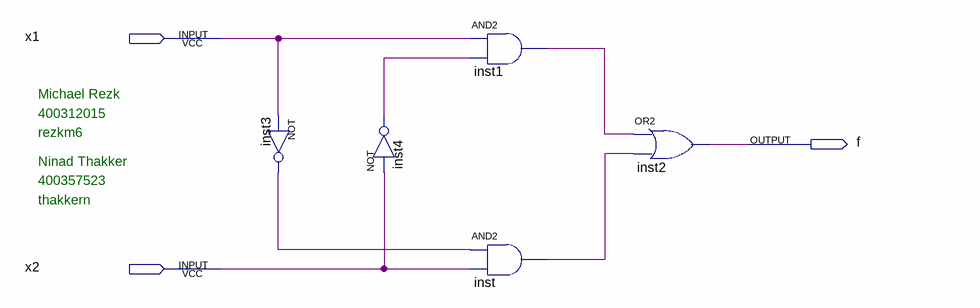
[diagram p0: schematic sheet]
// Quartus schematic light.bdf as structural Verilog: 5 symbols, 3 pins
module light (
  input  x1,
  input  x2,
  output f
);

  wire inst1_out, inst3_out, inst4_out, inst_out;

  not inst3 (inst3_out, x1);
  not inst4 (inst4_out, x2);
  and inst1 (inst1_out, x1, inst4_out);
  and inst (inst_out, inst3_out, x2);
  or inst2 (f, inst1_out, inst_out);

  // Notes on the sheet:
  //   Michael Rezk
  //   400312015
  //   rezkm6
  //   Ninad Thakker
  //   400357523
  //   thakkern
endmodule
